# EAGLE schematic IO Shield_With_Power_Supply_PCB (EAGLE 6.4)
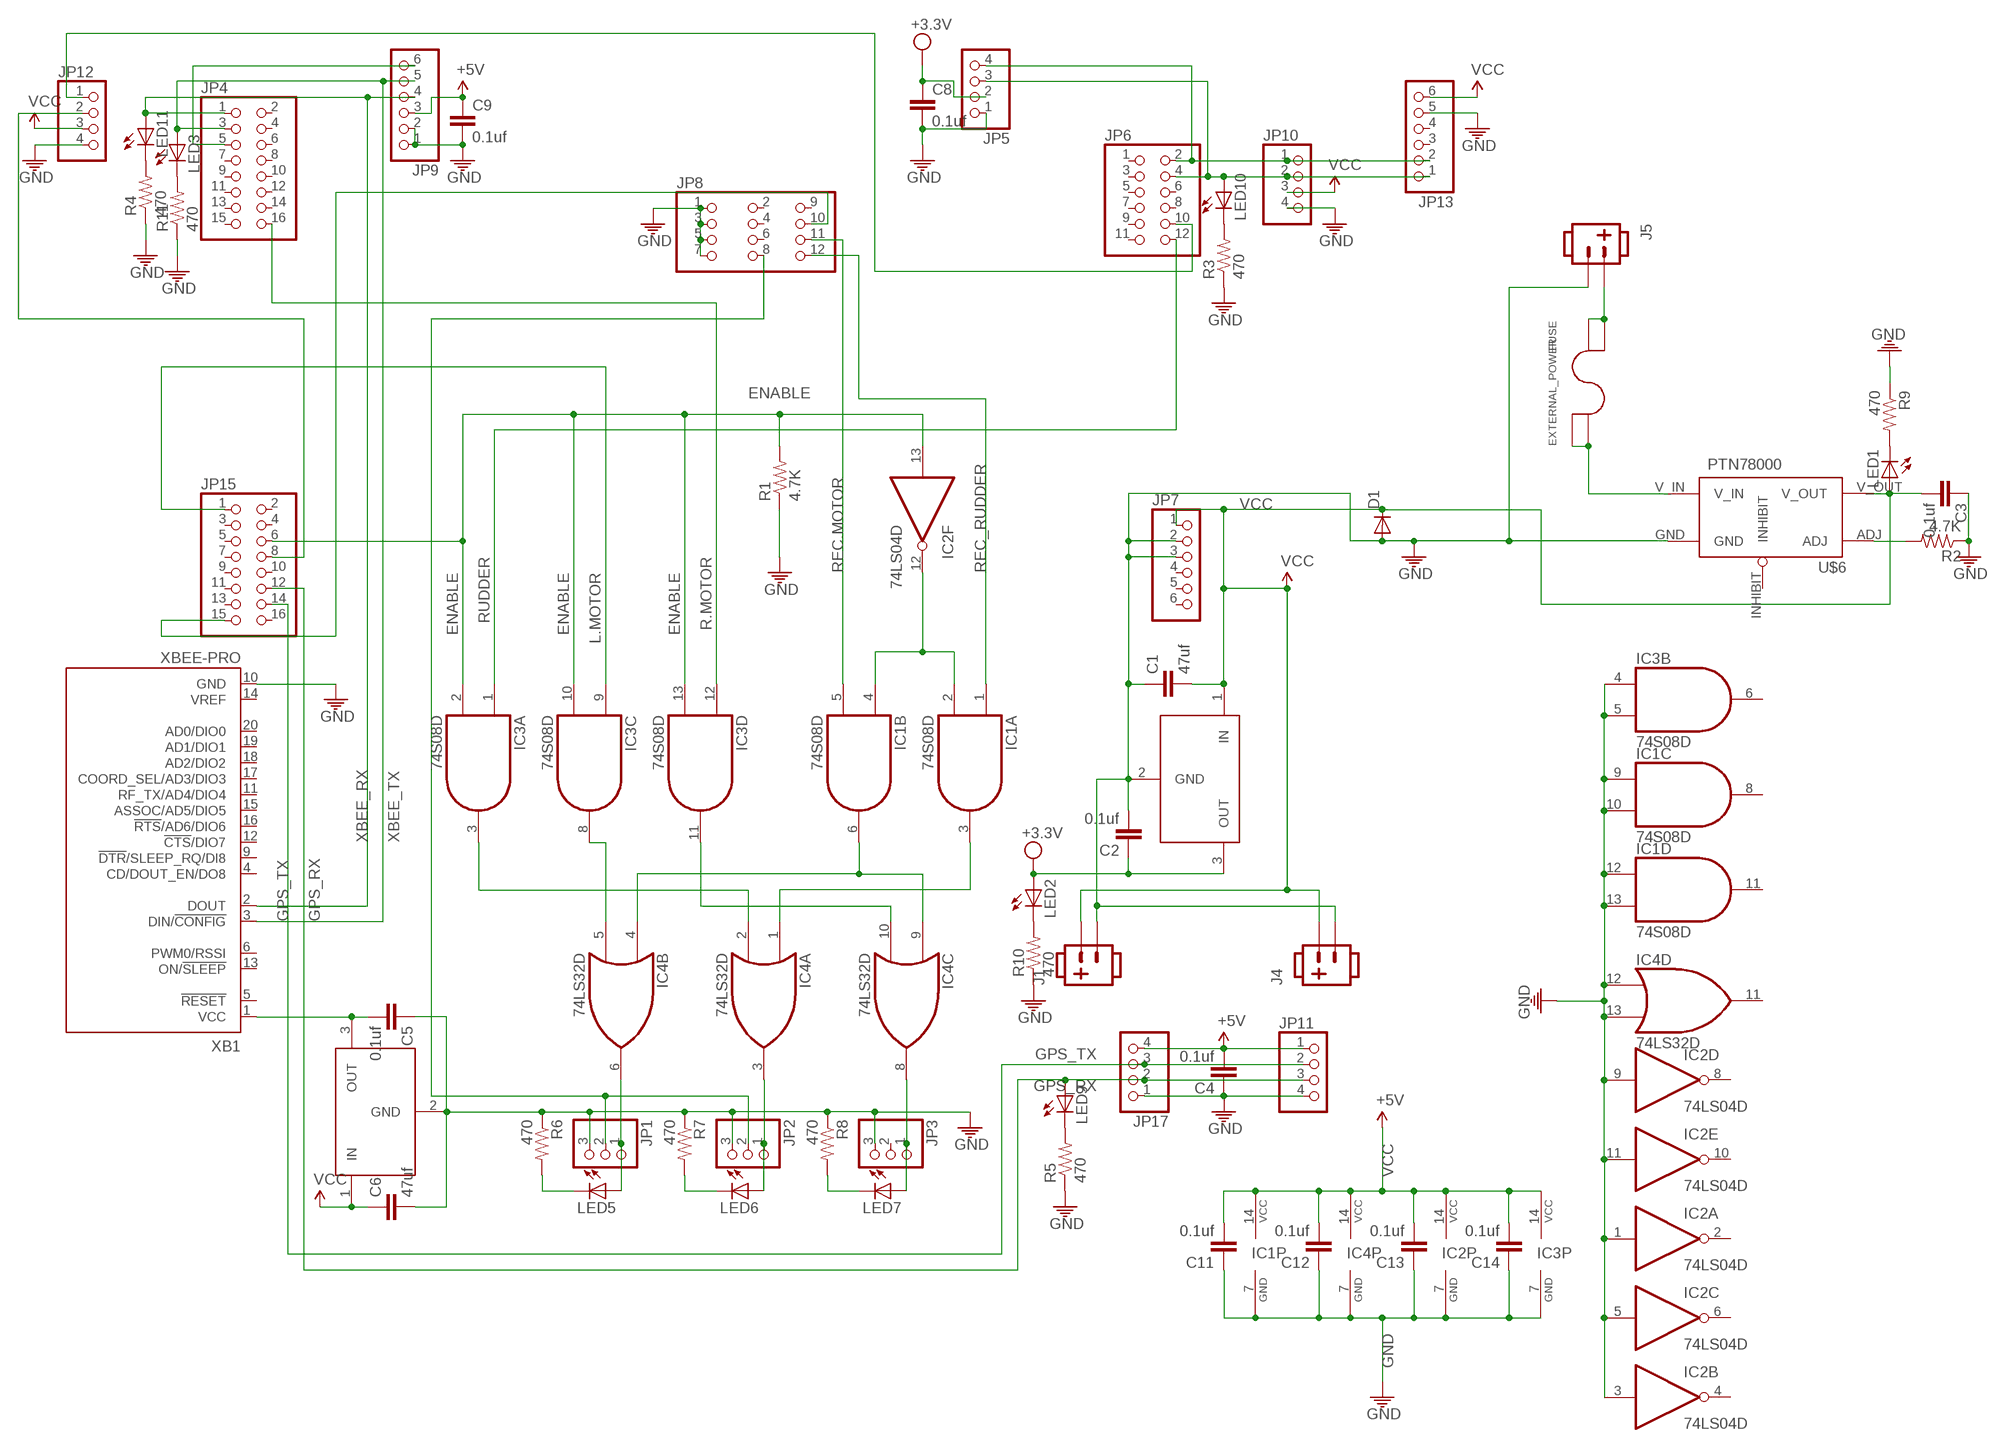
[diagram p0: schematic, sheet 1]

## Parts
C1  47uf  C-EUC0805  [C0805]
C2  0.1uf  C-EUC0805  [C0805]
C3  0.1uf  C-EUC0805  [C0805]
C4  0.1uf  C-EUC0805  [C0805]
C5  0.1uf  C-EUC0805  [C0805]
C6  47uf  C-EUC0805  [C0805]
C8  0.1uf  C-EUC0805  [C0805]
C9  0.1uf  C-EUC0805  [C0805]
C11  0.1uf  C-EUC0805  [C0805]
C12  0.1uf  C-EUC0805  [C0805]
C13  0.1uf  C-EUC0805  [C0805]
C14  0.1uf  C-EUC0805  [C0805]
D1  DIODEPTH  [DIODE-1N4001]
EXTERNAL_POWER  FUSE  [FUSE_2AG]
IC1  74S08D  [SO14]
IC2  74LS04D  [SO14]
IC3  74S08D  [SO14]
IC4  74LS32D  [SO14]
J1  POW_CONNECTFEMALE-RA  [SOCKET-FEMALE_RA-3.96MM-2]
J4  POW_CONNECTFEMALE-RA  [SOCKET-FEMALE_RA-3.96MM-2]
J5  POW_CONNECTFEMALE-RA  [SOCKET-FEMALE_RA-3.96MM-2]
JP1  PINHD-1X3/90  [1X03/90]
JP2  PINHD-1X3/90  [1X03/90]
JP3  PINHD-1X3/90  [1X03/90]
JP4  PINHD-2X8  [2X08]
JP5  PINHD-1X4  [1X04]
JP6  PINHD-2X6  [2X06]
JP7  PINHD-1X6  [1X06@1]
JP8  PINHD-2X4  [2X04]
JP9  PINHD-1X6  [1X06]
JP10  PINHD-1X4/90  [1X04/90]
JP11  PINHD-1X4/90  [1X04/90]
JP12  PINHD-1X4/90  [1X04/90]
JP13  PINHD-1X6  [1X06]
JP15  PINHD-2X8  [2X08]
JP17  PINHD-1X4  [1X04]
LED1  LED-FKIT-1206  [FKIT-LED-1206]
LED2  LED-FKIT-1206  [FKIT-LED-1206]
LED3  LED-FKIT-1206  [FKIT-LED-1206]
LED5  LED-FKIT-1206  [FKIT-LED-1206]
LED6  LED-FKIT-1206  [FKIT-LED-1206]
LED7  LED-FKIT-1206  [FKIT-LED-1206]
LED9  LED-FKIT-1206  [FKIT-LED-1206]
LED10  LED-FKIT-1206  [FKIT-LED-1206]
LED11  LED-FKIT-1206  [FKIT-LED-1206]
R1  4.7K  RESISTOR0805-RES  [0805]
R2  4.7K  RESISTOR0805-RES  [0805]
R3  470  RESISTOR0805-RES  [0805]
R4  470  RESISTOR0805-RES  [0805]
R5  470  RESISTOR0805-RES  [0805]
R6  470  RESISTOR0805-RES  [0805]
R7  470  RESISTOR0805-RES  [0805]
R8  470  RESISTOR0805-RES  [0805]
R9  470  RESISTOR0805-RES  [0805]
R10  470  RESISTOR0805-RES  [0805]
R11  470  RESISTOR0805-RES  [0805]
U$1  LM3940IMP-3.3  [SOT223]
U$6  PTN78000  PTN78000THROUGH-HOLE  [PTN78000]
U$7  LM3940IMP-3.3  [SOT223]
XB1  XBEE-PRO  [XBEE-PRO]

## Nets
ENABLE: IC2.13(F:I) IC3.2(A:I1) IC3.10(C:I1) IC3.13(D:I1) JP15.6 R1.2
GND: C1.1 C2.2 C3.1 C4.1 C5.1 C6.2 C8.2 C9.2 C11.1 C12.1 C13.1 C14.1 D1.A IC1.7(P:GND) IC1.9(C:I0) IC1.10(C:I1) IC1.12(D:I0) IC1.13(D:I1) IC2.1(A:I) IC2.3(B:I) IC2.5(C:I) IC2.7(P:GND) IC2.9(D:I) IC2.11(E:I) IC3.4(B:I0) IC3.5(B:I1) IC3.7(P:GND) IC4.7(P:GND) IC4.12(D:I0) IC4.13(D:I1) J1.2 J4.2 J5.2 JP1.3 JP2.3 JP3.3 JP5.1 JP7.2 JP7.3 JP8.1 JP8.3 JP8.5 JP8.7 JP9.1 JP9.2 JP10.4 JP11.4 JP12.4 JP13.5 JP17.1 R1.1 R2.1 R3.1 R4.1 R5.1 R6.1 R7.1 R8.1 R9.1 R10.1 R11.1 U$1.2(GND) U$6.GND U$7.2(GND) XB1.10(GND)
GPS_RX: JP11.3 JP15.12 JP17.2 LED9.A
GPS_TX: JP11.2 JP15.14 JP17.3
L.MOTOR: IC3.9(C:I0) JP15.1
N$1: IC1.3(A:O) IC4.1(A:I0)
N$2: IC1.6(B:O) IC4.4(B:I0) IC4.9(C:I0)
N$3: IC1.2(A:I1) IC1.4(B:I0) IC2.12(F:O)
N$4: JP6.10 JP12.1
N$5: IC3.11(D:O) IC4.10(C:I1)
N$6: IC3.8(C:O) IC4.5(B:I1)
N$7: JP12.2 JP15.8
N$8: IC4.6(B:O) JP1.1 LED5.A
N$9: IC4.3(A:O) JP2.1 LED6.A
N$10: IC4.8(C:O) JP3.1 LED7.A
N$12: JP1.2 JP2.2 JP8.8
N$13: EXTERNAL_POWER.P$1 EXTERNAL_POWER.P$2 U$6.V_IN
N$14: JP8.10 JP15.15
N$15: C5.2 U$7.3(OUT) XB1.1(VCC)
N$17: LED3.C R11.2
N$18: JP4.5 JP9.6
N$19: LED10.C R3.2
N$20: LED11.C R4.2
N$21: LED9.C R5.2
N$22: LED5.C R6.2
N$23: LED6.C R7.2
N$24: LED7.C R8.2
N$25: LED1.C R9.2
N$26: LED2.C R10.2
N$27: IC3.3(A:O) IC4.2(A:I1)
N$28: EXTERNAL_POWER.P$3 EXTERNAL_POWER.P$4 J5.1
N$35: R2.2 U$6.ADJ
R.MOTOR: IC3.12(D:I0) JP4.16
REC.MOTOR: IC1.5(B:I1) JP8.11
REC_RUDDER: IC1.1(A:I0) JP8.12
RUDDER: IC3.1(A:I0) JP6.12
SCL: JP5.4 JP6.2 JP10.1 JP13.2
SDA: JP5.3 JP6.4 JP10.2 JP13.1 LED10.A
VCC: C1.2 C3.2 C4.2 C6.1 C9.1 C11.2 C12.2 C13.2 C14.2 D1.C IC1.14(P:VCC) IC2.14(P:VCC) IC3.14(P:VCC) IC4.14(P:VCC) J1.1 J4.1 JP7.1 JP9.3 JP10.3 JP11.1 JP12.3 JP13.6 JP17.4 LED1.A U$1.1(IN) U$6.V_OUT U$7.1(IN) ; supply symbol labelled +5V
VDD: C2.1 C8.1 JP5.2 LED2.A U$1.3(OUT) ; supply symbol labelled +3.3V
XBEE_RX: JP4.1 JP9.4 LED11.A XB1.2(DOUT)
XBEE_TX: JP4.3 JP9.5 LED3.A XB1.3(DIN/!CONFIG)
Unconnected: IC1.8(C:O) IC1.11(D:O) IC2.2(A:O) IC2.4(B:O) IC2.6(C:O) IC2.8(D:O) IC2.10(E:O) IC3.6(B:O) IC4.11(D:O) JP3.2 JP4.2 JP4.4 JP4.6 JP4.7 JP4.8 JP4.9 JP4.10 JP4.11 JP4.12 JP4.13 JP4.14 JP4.15 JP6.1 JP6.3 JP6.5 JP6.6 JP6.7 JP6.8 JP6.9 JP6.11 JP7.4 JP7.5 JP7.6 JP8.2 JP8.4 JP8.6 JP8.9 JP13.3 JP13.4 JP15.2 JP15.3 JP15.4 JP15.5 JP15.7 JP15.9 JP15.10 JP15.11 JP15.13 JP15.16 U$6.INHIBIT XB1.4(CD/DOUT_EN/DO8) XB1.5(!RESET) XB1.6(PWM0/RSSI) XB1.9(!DTR!/SLEEP_RQ/DI8) XB1.11(RF_TX/AD4/DIO4) XB1.12(!CTS!/DIO7) XB1.13(ON/!SLEEP) XB1.14(VREF) XB1.15(ASSOC/AD5/DIO5) XB1.16(!RTS!/AD6/DIO6) XB1.17(COORD_SEL/AD3/DIO3) XB1.18(AD2/DIO2) XB1.19(AD1/DIO1) XB1.20(AD0/DIO0)

## Library data of the parts
C1-C6 C8 C9 C11-C14 = resistor:C-EU: CAPACITOR, European symbol
D1 = ASL:DIODE: Diode These are standard reverse protection diodes and small signal diodes. SMA package can handle up to about 1A. SOD-323 can handle about 200mA. What the SOD-323 package when ordering, there are some mfgs out there that are 5-pin packages.
EXTERNAL_POWER = ASL:FUSE
IC1 IC3 = 74xx-us:74*08: Quad 2-input AND gate
IC2 = 74xx-us:74*04: Hex INVERTER
IC4 = 74xx-us:74*32: Quad 2-input OR gate
J1 J4 J5 = ASL:POW_CONNECT
JP1-JP3 = pinhead:PINHD-1X3: PIN HEADER
JP4 JP15 = pinhead:PINHD-2X8: PIN HEADER
JP5 = SDLogger:PINHD-1X4: PIN HEADER
JP6 = pinhead:PINHD-2X6: PIN HEADER
JP7 = pinhead:PINHD-1X6: PIN HEADER
JP8 = pinhead:PINHD-2X4: PIN HEADER
JP9 = SDLogger:PINHD-1X6: PIN HEADER
JP10-JP12 JP17 = pinhead:PINHD-1X4: PIN HEADER
JP13 = baro:PINHD-1X6: PIN HEADER
LED1-LED3 LED5-LED7 LED9-LED11 = ASL:LED: LEDs Standard schematic elements and footprints for 5mm, 3mm, 1206, and 0603 sized LEDs. 5mm - Spark Fun Electronics SKU : COM-00529 (and others)
R1-R11 = ASL:RESISTOR: Resistor Basic schematic elements and footprints for 0603, 1206, and PTH resistors.
U$1 U$7 = LM3940:LM3940IMP-3.3: 1A Low Dropout Regulator for 5V to 3.3V Conversion
U$6 = ASL:PTN78000: This is the PTN78000 part by Texas Instruments. It's a 1.5A adjustable switching regulator.
XB1 = maxstream:XBEE: XBee (TM) /XBee-PRO(TM) OEM RF Modules Source: MaxStream, Inc. xbee_productmanual.pdf; MPN: XBP24-AWI-001; OC_FARNELL: 1337916; OC_NEWARK: 42M2667